# Altium schematic sheet Main Schematics.SchDoc: Main Schematics
size A4; DocumentNumber: 3; SheetNumber: 3; SheetTotal: 3
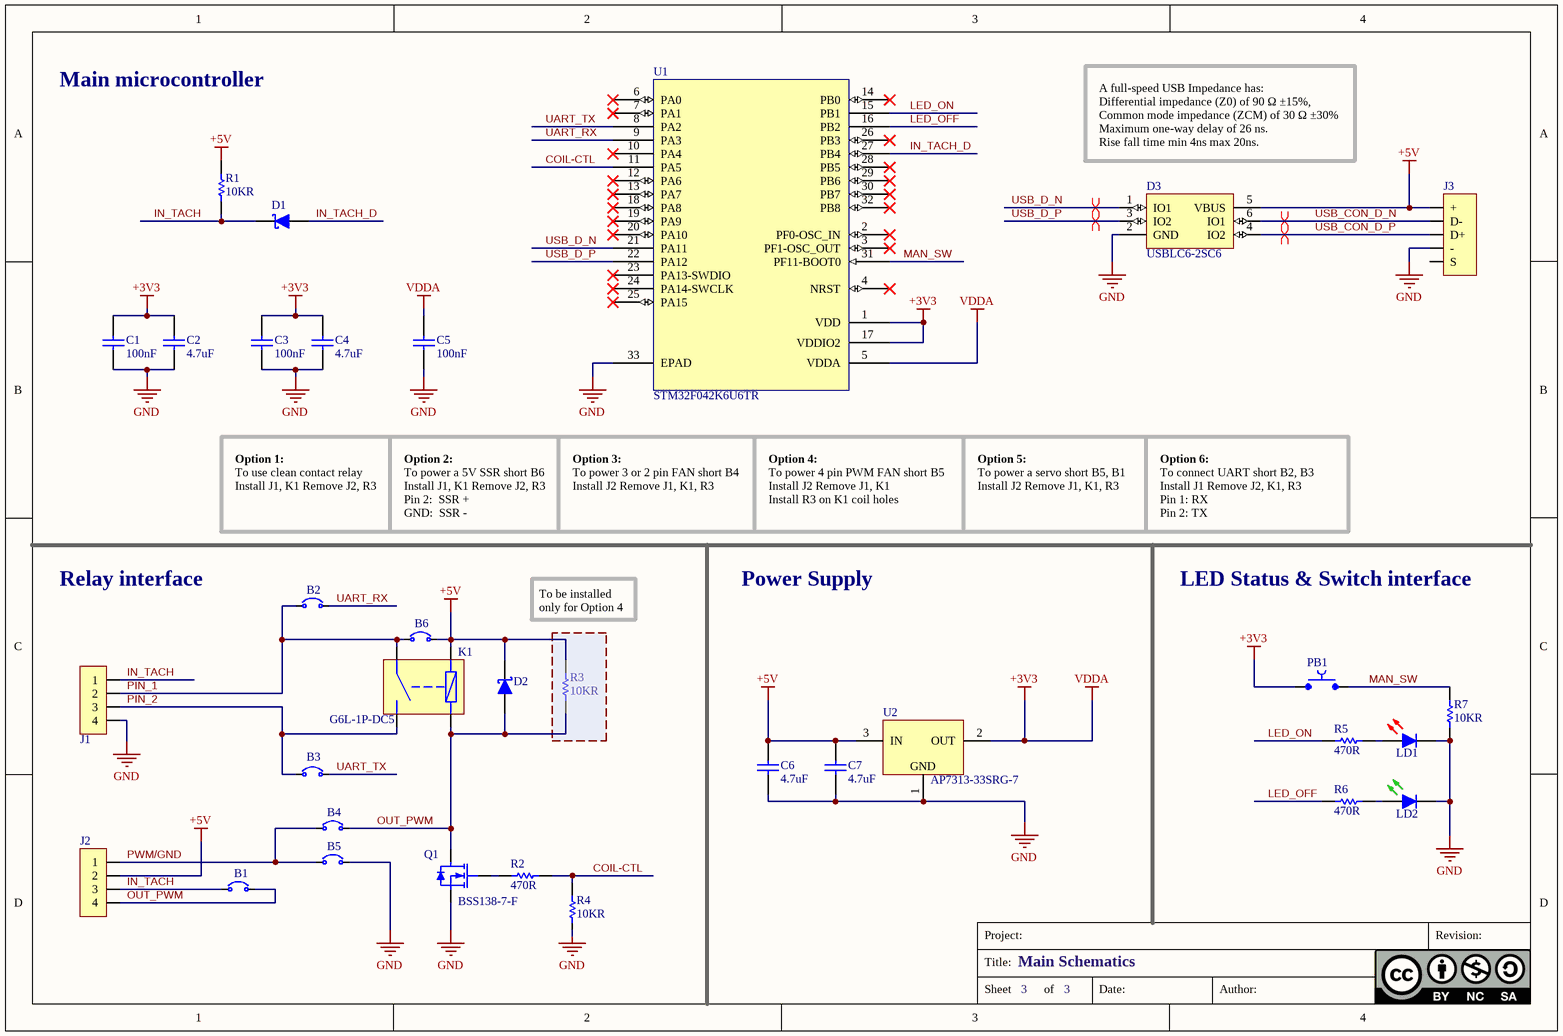
[diagram p0: Main Schematics.SchDoc]

## Parts
B1  _SMD-JUMP-0603  [_SMD-JUMP-0603]  (value not drawn)  (no BOM)
B2  _SMD-JUMP-0603  [_SMD-JUMP-0603]  (value not drawn)  (no BOM)
B3  _SMD-JUMP-0603  [_SMD-JUMP-0603]  (value not drawn)  (no BOM)
B4  _SMD-JUMP-0603  [_SMD-JUMP-0603]  (value not drawn)  (no BOM)
B5  _SMD-JUMP-0603  [_SMD-JUMP-0603]  (value not drawn)  (no BOM)
B6  _SMD-JUMP-0603  [_SMD-JUMP-0603]  (value not drawn)  (no BOM)
C1  100nF  [C0603-H90]
C2  4.7uF  [C0603-H90]
C3  100nF  [C0603-H90]
C4  4.7uF  [C0603-H90]
C5  100nF  [C0603-H90]
C6  4.7uF  [C0603-H90]
C7  4.7uF  [C0603-H90]
D1  BAT54WS-7-F  [SOD-323]  (value not drawn)
D2  BAT54WS-7-F  [SOD-323]  (value not drawn)
D3  USBLC6-2SC6  [SOT-236]
J1  691210910004  [691210910004]  (value not drawn)
J2  CO975  [FAN-HDR-4P-90DEG]  (value not drawn)
J3  USB-AP-S-RA  [48037-0001]  (value not drawn)
K1  G6L-1P-DC5  [G6L-1P]
LD1  LTST-C191KRKT  [LED-0603-R]  (value not drawn)
LD2  LTST-C191KGKT  [LED-0603-G]  (value not drawn)
PB1  SKQMAQE010  [SKQMA-SERIE]  (value not drawn)
Q1  BSS138-7-F  [SOT-23]
R1  10KR  [R0603-H55]
R2  470R  [R0603-H55]
R3  10KR  [RAXIAL-1/8W]
R4  10KR  [R0603-H55]
R5  470R  [R0603-H55]
R6  470R  [R0603-H55]
R7  10KR  [R0603-H55]
U1  STM32F042K6U6TR  [UFQFPN32-5x5]
U2  AP7313-33SRG-7  [SOT-23]

## Nets
+3V3: C1.2 C2.2 C3.2 C4.2 C5.2 PB1.1 U1.1(VDD) U1.5(VDDA) U1.17(VDDIO2) U2.2(OUT)  [also labelled VDDA]
+5V: B6.1 C6.2 C7.2 D2.1(K) D3.5(VBUS) J2.2 J3.1(+) K1.8 R1.2 R3.2 U2.3(IN)
GND: B5.1 C1.1 C2.1 C3.1 C4.1 C5.1 C6.1 C7.1 D3.2(GND) J1.4 J3.4(-) LD1.1(K) LD2.1(K) Q1.2(S) R4.1 R7.1 U1.33(EPAD) U2.1(GND)
COIL-CTL: R2.2 R4.2 U1.11(PA5)
IN_TACH: B1.2 D1.1(K) J1.1 J2.3 R1.1
IN_TACH_D: D1.2(A) U1.27(PB4)
LED_OFF: R6.1 U1.16(PB2)
LED_ON: R5.1 U1.15(PB1)
MAN_SW: PB1.2 R7.2 U1.31(PF11-BOOT0)
OUT_PWM: B1.1 B4.1 D2.2(A) J2.4 K1.5 Q1.3(D) R3.1
PIN_1: B2.2 B6.2 J1.2 K1.2(C)
PIN_2: B3.2 J1.3 K1.4(NO)
PWM/GND: B4.2 B5.2 J2.1
UART_RX: B2.1 U1.9(PA3)
UART_TX: B3.1 U1.8(PA2)
USB_CON_D_N: D3.6(IO1) J3.2(D-)
USB_CON_D_P: D3.4(IO2) J3.3(D+)
USB_D_N: D3.1(IO1) U1.21(PA11)
USB_D_P: D3.3(IO2) U1.22(PA12)
NetLD1_2: LD1.2(A) R5.2
NetLD2_2: LD2.2(A) R6.2
NetQ1_1: Q1.1(G) R2.1

Not connected (* = marked no-connect by the designer): J3 S; U1 2(PF0-OSC_IN)* 3(PF1-OSC_OUT)* 4(NRST)* 6(PA0)* 7(PA1)* 10(PA4)* 12(PA6)* 13(PA7)* 14(PB0)* 18(PA8)* 19(PA9)* 20(PA10)* 23(PA13-SWDIO)* 24(PA14-SWCLK)* 25(PA15)* 26(PB3)* 28(PB5)* 29(PB6)* 30(PB7)* 32(PB8)*

## Layout directives
differential pair: USB_CON_D_N, USB_CON_D_P, USB_D_N, USB_D_P

## Notes on the sheet
- Main microcontroller
- (near D3) A full-speed USB Impedance has:
  Differential impedance (Z0) of 90 Ω ±15%,
  Common mode impedance (ZCM) of 30 Ω ±30%
  Maximum one-way delay of 26 ns.
  Rise fall time min 4ns max 20ns.
- To use clean contact relay
  Install J1, K1 Remove J2, R3
- Option 1:
- To power a 5V SSR short B6
  Install J1, K1 Remove J2, R3
  Pin 2:  SSR +
  GND:  SSR -
- Option 2:
- To power 3 or 2 pin FAN short B4
  Install J2 Remove J1, K1, R3
- Option 3:
- To power 4 pin PWM FAN short B5
  Install J2 Remove J1, K1
  Install R3 on K1 coil holes
- Option 4:
- To power a servo short B5, B1
  Install J2 Remove J1, K1, R3
- Option 5:
- To connect UART short B2, B3
  Install J1 Remove J2, K1, R3
  Pin 1: RX
  Pin 2: TX
- Option 6:
- Relay interface
- To be installed only for Option 4
- Power Supply
- LED Status & Switch interface
- Title:
- Project:
- Revision:
- Sheet
- of
- Date:
- Author:

## Library data of the parts
B1-B6 = _SMD-JUMP-0603: Option Jumper smd 0603; Mount: Surface Mount; Case: 0603
C1 C3 C5 = CGA3E2X7R1H104K080AA: Cap 0603 Case Ceramic 100nF 50V X7R; Manufacturer: TDK; Value: 100n; Manufacturer Part Number: CGA3E2X7R1H104K080AA; Mount: Surface Mount; Case: 0603; Capacitance: 100nF; Dielectric: X7R; Voltage Rating: 50V; ComponentLink1URL: https://product.tdk.com/system/files/dam/doc/product/capacitor/ceramic/mlcc/catalog/mlcc_commercial_general_en.pdf; ComponentLink1Description: Data Sheet
C2 C4 C6 C7 = GRM188Z71C475KE21D: Cap 0603 Case Ceramic 4.7uF 16V X7R; Manufacturer: Murata; Value: 4.7u; Manufacturer Part Number: GRM188Z71C475KE21D; Mount: Surface Mount; Case: 0603; Capacitance: 4.7uF; Dielectric: X7R; Voltage Rating: 16V; ComponentLink1URL: https://www.murata.com/en-eu/products/productdetail?partno=GRM188Z71C475KE21%23; ComponentLink1Description: Data Sheet
D1 D2 = BAT54WS-7-F: Diode Schottky 30V 0.1A, Vf 400mV@10mA SOD-323; Manufacturer: Diodes; Manufacturer Part Number: BAT54WS-7-F; Mount: Surface Mount; Case: SOD-323; Current Rating: 0.1A; ComponentLink1URL: https://eu.mouser.com/datasheet/2/115/DIOD_S_A0004140728_1-2542383.pdf; ComponentLink1Description: Data Sheet
D3 = USBLC6-2SC6: ESD Protection Diodes / TVS Diodes 2 Line 2.5pF USB 2.0 ESD Protect SOT23-6; Manufacturer: STMicroelectronics; Manufacturer Part Number: USBLC6-2SC6; Mount: Surface Mount; ComponentLink1URL: https://www.mouser.it/datasheet/2/389/usblc6_2-1852789.pdf; ComponentLink1Description: Data Sheet; Case: SOT-23-6
J1 = 691210910004: Conn Term Block Header Screw 2.54 mm 4 Pos 6A 150V; Manufacturer: Wurth Electronics; Manufacturer Part Number: 691210910004; Mount: Through Hole; ComponentLink1URL: https://www.we-online.com/components/products/datasheet/691210910002.pdf; ComponentLink1Description: Data Sheet; Current Rating: 6A; Voltage Rating: 150V
J2 = CO975: Conn Post Header - PWM Fan - 90 Deg - 4 Pos - Series KK254; Manufacturer: Moddy; Current Rating: 4A; Voltage Rating: 250V; Manufacturer Part Number: CO975; Mount: Through Hole; ComponentLink1URL: https://www.moddiy.com/products/4-Pin-3-Pin-2.54mm-Pitch-2510-Fan-Male-Angled-Connector-Black.html?srsltid=AfmBOopaZVadWC9c1TxHb48VLoAs6cq4o3WMRMmuPV4D0msjLx6o7yLs; ComponentLink1Description: Data Sheet
J3 = USB-AP-S-RA: Conn USB Type A Plug Right-Anglel TH; Manufacturer: Adam Tech; Voltage Rating: 30V; Current Rating: 1A; Manufacturer Part Number: USB-AP-S-RA; Mount: Through Hole; ComponentLink1URL: https://www.mouser.it/datasheet/2/4/usb_ap_s_ra_data_sheet-3396036.pdf; ComponentLink1Description: Data Sheet
K1 = G6L-1P-DC5: Relay Low Signal Sealed SPST-NO 1A 5VDC Through Hole Tube; Manufacturer: Omron; Manufacturer Part Number: G6L-1P-DC5; ComponentLink1URL: http://www.farnell.com/datasheets/1846831.pdf; ComponentLink1Description: Data Sheet; Mount: Through Hole
LD1 = LTST-C191KRKT: LED 0603 Top Red 631nm 2-Pin; Manufacturer: Vishay Semiconductors; Manufacturer Part Number: LTST-C191KRKT; Mount: Surface Mount; Case: 0603; ComponentLink1URL: https://optoelectronics.liteon.com/upload/download/DS22-2000-223/LTST-C191KRKT.PDF; ComponentLink1Description: Data Sheet
LD2 = LTST-C191KGKT: LED 0603 Top Green 571nm 2-Pin; Manufacturer: Vishay Semiconductors; Manufacturer Part Number: LTST-C191KGKT; Mount: Surface Mount; Case: 0603; ComponentLink1URL: https://optoelectronics.liteon.com/upload/download/DS22-2000-228/LTST-C191KGKT.PDF; ComponentLink1Description: Data Sheet
PB1 = SKQMAQE010: Tactile Switch Rectangular 6.00x3.55mm. Height 4.3mm. J-Lead 50mA 12VDC 260gf SMD; Manufacturer: Alps Alpine; Voltage Rating: 12V; Manufacturer Part Number: SKQMAQE010; Mount: Surface Mount; Current Rating: 50 mA; ComponentLink1URL: https://eu.mouser.com/datasheet/2/15/SKQM-1370716.pdf; ComponentLink1Description: Data Sheet
Q1 = BSS138-7-F: Mosfet N 50V Vds 20V Vgs 1.4R SOT-23; Manufacturer: Diodes; Manufacturer Part Number: BSS138-7-F; Mount: Surface Mount; Case: SOT-23; ComponentLink1Description: Data Sheet; ComponentLink1URL: https://www.diodes.com/assets/Datasheets/ds30144.pdf
R1 R4 R7 = RC0603FR-0710KL: Resistor 0603 Case 10KR 1% 1/10W; Manufacturer: Yageo; Voltage Rating: 150V; Value: 10K; Manufacturer Part Number: RC0603FR-0710KL; Case: 0603; Resistance: 10KR; ComponentLink1URL: https://datasheet.ciiva.com/2519/pyu-r-int-thick-7-2519712.pdf; ComponentLink1Description: Data Sheet; Mount: Surface Mount
R2 R5 R6 = RC0603FR-07470RL: Resistor 0603 Case 470R 1% 1/10W; Manufacturer: Yageo; Voltage Rating: 150V; Value: 470; Manufacturer Part Number: RC0603FR-07470RL; Case: 0603; Resistance: 470R; ComponentLink1URL: https://datasheet.ciiva.com/11808/0900766b8106beab-11808155.pdf; ComponentLink1Description: Data Sheet; Mount: Surface Mount
R3 = RNF18FTD10K0: Resistor Axial 10KR 1% 1/8W; Manufacturer: SEI Stackpole; Voltage Rating: 200V; Value: 10K; Manufacturer Part Number: RNF18FTD10K0; Case: Through Hole; Resistance: 10KR; ComponentLink1URL: https://www.seielect.com/Catalog/SEI-RNF_RNMF.pdf; ComponentLink1Description: Data Sheet; Mount: Through Hole
U1 = STM32F042K6U6TR: STM32 Arm Cortex-M0 USB line MCU 32 Kbytes of Flash 48 MHz CPU USB CAN CEC; Manufacturer: STMicroelectronics; Frequency: 48 MHz; Manufacturer Part Number: STM32F042K6U6TR; Mount: Surface Mount; Case: UFQFPN32; ComponentLink1Description: DataSheet; ComponentLink1URL: https://www.st.com/resource/en/datasheet/stm32f042f4.pdf
U2 = AP7313-33SRG-7: LDO 3.3V 150mA Out  6Vin 130mV Dropout, Quiescent current 65uA Startup 80µs SOT-23; Manufacturer: Diodes; Manufacturer Part Number: AP7313-33SRG-7; ComponentLink1Description: Data Sheet; ComponentLink1URL: https://www.diodes.com/assets/Datasheets/AP7313.pdf; Mount: Surface Mount; Case: SOT-23